# EAGLE schematic PCB_Draft_4 (EAGLE 9.6.2)
AUTHOR: R. Hall, A. Singh, K.Quizon; BOARD_NAME: ESP32 I2C Exp / M Driver; DOC_NUM: 0; PROJECT_NAME: R8-O7 PCB; REVISION: 4
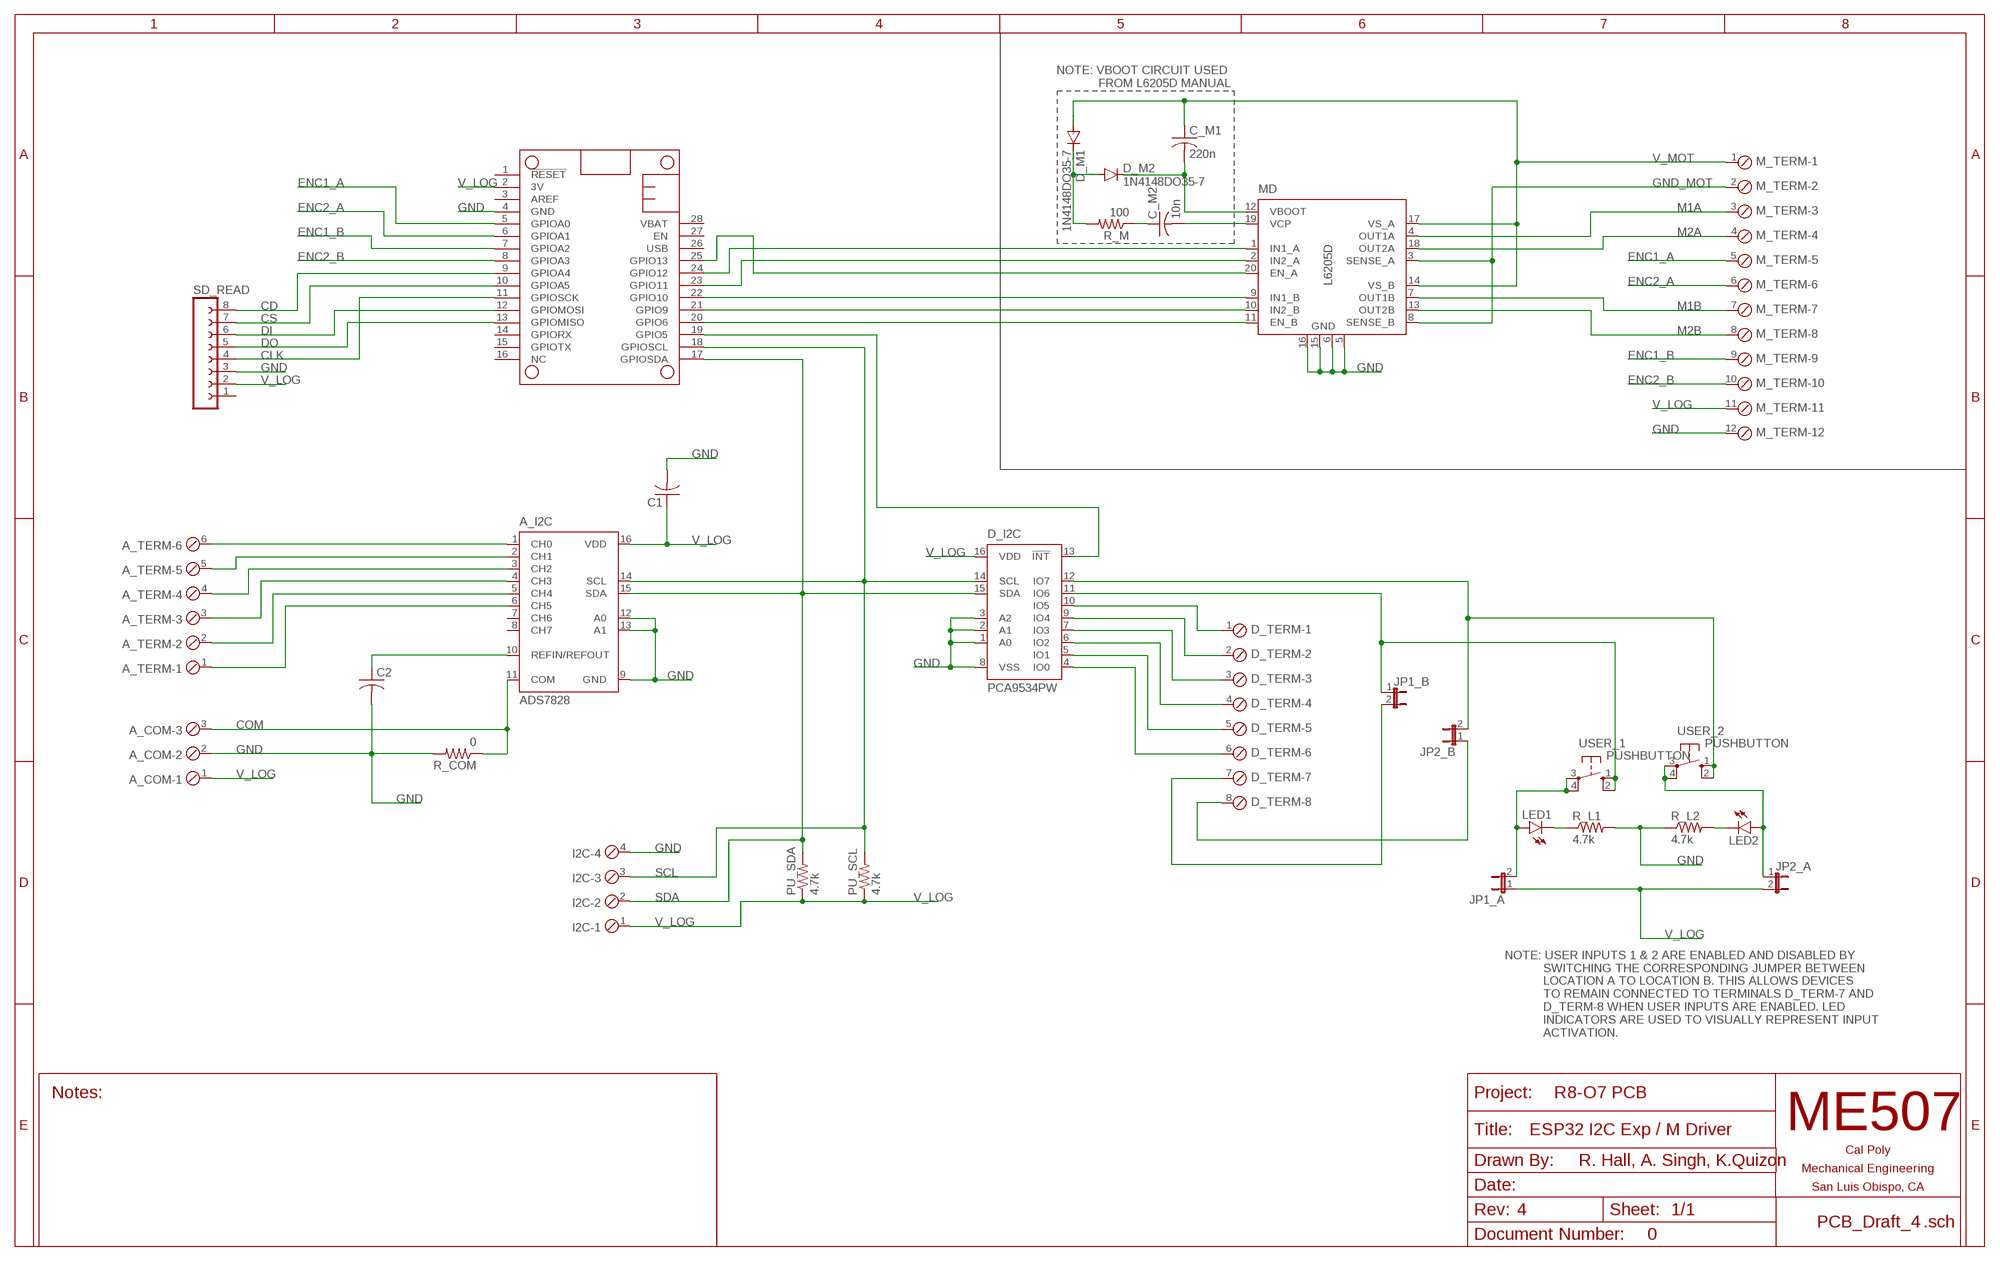
[diagram p0: schematic, sheet 1]

## Parts
A_COM  SCREWTERM_3P_254  [3POL254]
A_I2C  ADS7828  [TSSOP16-PW]
A_TERM  SCREWTERM_6P_254  [6POL254]
C1  C-USC0805  [C0805]
C2  C-USC0805  [C0805]
C_M1  220n  C-USC0805  [C0805]
C_M2  10n  C-USC0805  [C0805]
D_I2C  PCA9534PW  [TSSOP16]
D_M1  1N4148DO35-7  [DO35-7]
D_M2  1N4148DO35-7  [DO35-7]
D_TERM  SCREWTERM_8P_254  [8POL254]
FTHRWNG  FEATHERWINGEXTENDED_BOTH_ENDS  [FEATHERWING]
I2C  SCREWTERM_4P_254  [4POL254]
JP1_A  JP1E  [JP1]
JP1_B  JP1E  [JP1]
JP2_A  JP1E  [JP1]
JP2_B  JP1E  [JP1]
LED1  LEDCHIP-LED0805  [CHIP-LED0805]
LED2  LEDCHIP-LED0805  [CHIP-LED0805]
M_TERM  SCREWTERM_12P_254  [12POL254]
MD  L6205D  [SO20]
PU_SCL  4.7k  R-US_M0805  [M0805]
PU_SDA  4.7k  R-US_M0805  [M0805]
R_COM  0  R-US_M0805  [M0805]
R_L1  4.7k  R-US_M0805  [M0805]
R_L2  4.7k  R-US_M0805  [M0805]
R_M  100  R-US_M0805  [M0805]
SD_READ  FE08-1  [FE08]
USER_1  PUSHBUTTON  [B3F-10XX]
USER_2  PUSHBUTTON  [B3F-10XX]

## Nets
CD: FTHRWNG.9(GPIOA4) SD_READ.8
CLK: FTHRWNG.11(GPIOSCK) SD_READ.4
COM: A_COM.3 A_I2C.11(COM) R_COM.1
CS: FTHRWNG.10(GPIOA5) SD_READ.7
DI: FTHRWNG.12(GPIOMOSI) SD_READ.6
DO: FTHRWNG.13(GPIOMISO) SD_READ.5
ENC1_A: FTHRWNG.5(GPIOA0) M_TERM.5
ENC1_B: FTHRWNG.7(GPIOA2) M_TERM.9
ENC2_A: FTHRWNG.6(GPIOA1) M_TERM.6
ENC2_B: FTHRWNG.8(GPIOA3) M_TERM.10
GND: A_COM.2 A_I2C.9(GND) A_I2C.12(A0) A_I2C.13(A1) C1.2 C2.2 D_I2C.1(A0) D_I2C.2(A1) D_I2C.3(A2) D_I2C.8(VSS) FTHRWNG.4(GND) I2C.4 M_TERM.12 MD.5(GND) MD.6(GND) MD.15(GND) MD.16(GND) R_COM.2 R_L1.2 R_L2.1 SD_READ.3
GND_MOT: M_TERM.2 MD.3(SENSE_A) MD.8(SENSE_B)
M1A: M_TERM.3 MD.4(OUT1A)
M1B: M_TERM.7 MD.7(OUT1B)
M2A: M_TERM.4 MD.18(OUT2A)
M2B: M_TERM.8 MD.13(OUT2B)
N$1: D_I2C.12(IO7) JP2_B.2 USER_2.1(S) USER_2.2(S1)
N$2: D_I2C.11(IO6) JP1_B.1 USER_1.1(S) USER_1.2(S1)
N$3: D_I2C.10(IO5) D_TERM.1
N$4: D_I2C.9(IO4) D_TERM.2
N$5: D_I2C.7(IO3) D_TERM.3
N$6: D_I2C.6(IO2) D_TERM.4
N$8: D_TERM.7 JP1_B.2
N$9: A_I2C.1(CH0) A_TERM.6
N$10: A_I2C.2(CH1) A_TERM.5
N$11: A_I2C.3(CH2) A_TERM.4
N$12: A_I2C.4(CH3) A_TERM.3
N$13: A_I2C.5(CH4) A_TERM.2
N$14: A_I2C.6(CH5) A_TERM.1
N$17: A_I2C.10(REFIN/REFOUT) C2.1
N$18: FTHRWNG.20(GPIO6) MD.11(EN_B)
N$19: D_I2C.13(!INT) FTHRWNG.19(GPIO5)
N$20: FTHRWNG.21(GPIO9) MD.10(IN2_B)
N$21: FTHRWNG.22(GPIO10) MD.9(IN1_B)
N$22: FTHRWNG.23(GPIO11) MD.2(IN2_A)
N$23: FTHRWNG.24(GPIO12) MD.1(IN1_A)
N$25: FTHRWNG.25(GPIO13) MD.20(EN_A)
N$26: JP1_A.2 LED1.A USER_1.3(P) USER_1.4(P1)
N$27: JP2_A.1 LED2.A USER_2.3(P) USER_2.4(P1)
N$29: LED1.C R_L1.1
N$30: LED2.C R_L2.2
N$32: D_I2C.5(IO1) D_TERM.5
N$33: D_I2C.4(IO0) D_TERM.6
N$35: D_TERM.8 JP2_B.1
N$44: C_M2.1 R_M.1
N$45: D_M1.C D_M2.A R_M.2
SCL: A_I2C.14(SCL) D_I2C.14(SCL) FTHRWNG.18(GPIOSCL) I2C.3 PU_SCL.2
SDA: A_I2C.15(SDA) D_I2C.15(SDA) FTHRWNG.17(GPIOSDA) I2C.2 PU_SDA.2
V_LOG: A_COM.1 A_I2C.16(VDD) C1.1 D_I2C.16(VDD) FTHRWNG.2(3V) I2C.1 JP1_A.1 JP2_A.2 M_TERM.11 PU_SCL.1 PU_SDA.1 SD_READ.2
V_MOT: C_M1.1 D_M1.A M_TERM.1 MD.14(VS_B) MD.17(VS_A)
VBOOT: C_M1.2 D_M2.C MD.12(VBOOT)
VCP: C_M2.2 MD.19(VCP)
Unconnected: A_I2C.7(CH6) A_I2C.8(CH7) FTHRWNG.1(!RESET) FTHRWNG.3(AREF) FTHRWNG.14(GPIORX) FTHRWNG.15(GPIOTX) FTHRWNG.16(NC) FTHRWNG.26(USB) FTHRWNG.27(EN) FTHRWNG.28(VBAT) SD_READ.1

## Notes on the sheet
- NOTE: VBOOT CIRCUIT USED 
              FROM L6205D MANUAL
- NOTE: USER INPUTS 1 & 2 ARE ENABLED AND DISABLED BY   
             SWITCHING THE CORRESPONDING JUMPER BETWEEN 
             LOCATION A TO LOCATION B. THIS ALLOWS DEVICES 
             TO REMAIN CONNECTED TO TERMINALS D_TERM-7 AND 
             D_TERM-8 WHEN USER INPUTS ARE ENABLED. LED 
             INDICATORS ARE USED TO VISUALLY REPRESENT INPUT 
             ACTIVATION.

## Library data of the parts
A_COM = ME507:SCREWTERM_3P: Screw Terminal Block This part is designed for a screw terminal connector. The 2.54mm (0.100 inch) foorprint can also be used for male or female pin headers such as those on most development boards. One can also solder wires directly into the holes, though this makes modifications or repairs to the system more inconvenient. Larger versions can carry more current.
A_I2C = burr-brown:ADS7828: 12-Bit, 8-Channel Sampling ANALOG-TO-DIGITAL CONVERTER with I2C? Interface Source: www.ti.com .. ADS7828.pdf; MF: TEXAS INSTRUMENTS; MPN: ADS7828E/250; OC_FARNELL: 1470338; OC_NEWARK: 74C7158
A_TERM = ME507:SCREWTERM_6P: Screw Terminal Block This part is designed for a screw terminal connector. The 2.54mm (0.100 inch) foorprint can also be used for male or female pin headers such as those on most development boards. One can also solder wires directly into the holes, though this makes modifications or repairs to the system more inconvenient. Larger versions can carry more current.
C1 C2 C_M1 C_M2 = rcl:C-US: CAPACITOR, American symbol; SPICEPREFIX: C
D_I2C = micro-philips:PCA9534: 8-bit I2C-bus and SMBus low power I/O port with interrupt Source: www.nxp.com .. PCA9534_3.pdf; MPN: PCA9534PW; OC_FARNELL: 1408285; OC_NEWARK: 18M7516
D_M1 D_M2 = diode:1N4148: DIODE high speed (Philips)
D_TERM = ME507:SCREWTERM_8P: Screw Terminal Block This part is designed for a screw terminal connector. The 2.54mm (0.100 inch) foorprint can also be used for male or female pin headers such as those on most development boards. One can also solder wires directly into the holes, though this makes modifications or repairs to the system more inconvenient. Larger versions can carry more current.
FTHRWNG = ME507:FEATHERWING: AdaFruitTM Feather Wing A modified version of a Featherwing, the add-on board for an AdaFruit(tm) Feather development board. There is a standard size version which is the same size as the Feather board on which the microcontroller hangs out. There is also an extended version, with each and longer by a quarter inch to allow for connectors such as screw terminals which aren't hidden under another board if this wing isn't on the top of the board stack. The pins are named in a generic fashion; these names do not necessarily correspond to Arduino or Python pin numbers. The designer must refer to the pinout diagram for each specific Feather board to find the functions of each pin.
I2C = ME507:SCREWTERM_4P: Screw Terminal Block This part is designed for a screw terminal connector. The 2.54mm (0.100 inch) foorprint can also be used for male or female pin headers such as those on most development boards. One can also solder wires directly into the holes, though this makes modifications or repairs to the system more inconvenient. Larger versions can carry more current.
JP1_A JP1_B JP2_A JP2_B = jumper:JP1E: JUMPER
LED1 LED2 = led:LED: LED OSRAM: - CHIPLED LG R971, LG N971, LY N971, LG Q971, LY Q971, LO R971, LY R971 LH N974, LH R974 LS Q976, LO Q976, LY Q976 LO Q996 - Hyper CHIPLED LW Q18S LB Q993, LB Q99A, LB R99A - SideLED LS A670, LO A670, LY A670, LG A670, LP A670 LB A673, LV A673, LT A673, LW A673 LH A674 LY A675 LS A676, LA A676, LO A676, LY A676, LW A676 LS A679, LY A679, LG A679 - Hyper Micro SIDELED® LS Y876, LA Y876, LO Y876, LY Y876 LT Y87S - SmartLED LW L88C, LW L88S LB L89C, LB L89S, LG L890 LS L89K, LO L89K, LY L89K LS L896, LA L896, LO L896, LY L896 - TOPLED LS T670, LO T670, LY T670, LG T670, LP T670 LSG T670, LSP T670, LSY T670, LOP T670, LYG T670 LG T671, LOG T671, LSG T671 LB T673, LV T673, LT T673, LW T673 LH T674 LS T676, LA T676, LO T676, LY T676, LB T676, LH T676, LSB T676, LW T676 LB T67C, LV T67C, LT T67C, LS T67K, LO T67K, LY T67K, LW E67C LS E67B, LA E67B, LO E67B, LY E67B, LB E67C, LV E67C, LT E67C LW T67C LS T679, LY T679, LG T679 LS T770, LO T770, LY T770, LG T770, LP T770 LB T773, LV T773, LT T773, LW T773 LH T774 LS E675, LA E675, LY E675, LS T675 LS T776, LA T776, LO T776, LY T776, LB T776 LHGB T686 LT T68C, LB T68C - Hyper Mini TOPLED® LB M676 - Mini TOPLED Santana® LG M470 LS M47K, LO M47K, LY M47K Source: http://www.osram.convergy.de LUXEON: - LUMILED® LXK2-PW12-R00, LXK2-PW12-S00, LXK2-PW14-U00, LXK2-PW14-V00 LXK2-PM12-R00, LXK2-PM12-S00, LXK2-PM14-U00 LXK2-PE12-Q00, LXK2-PE12-R00, LXK2-PE12-S00, LXK2-PE14-T00, LXK2-PE14-U00 LXK2-PB12-K00, LXK2-PB12-L00, LXK2-PB12-M00, LXK2-PB14-N00, LXK2-PB14-P00, LXK2-PB14-Q00 LXK2-PR12-L00, LXK2-PR12-M00, LXK2-PR14-Q00, LXK2-PR14-R00 LXK2-PD12-Q00, LXK2-PD12-R00, LXK2-PD12-S00 LXK2-PH12-R00, LXK2-PH12-S00 LXK2-PL12-P00, LXK2-PL12-Q00, LXK2-PL12-R00 Source: www.luxeon.com KINGBRIGHT: KA-3528ASYC Source: www.kingbright.com
M_TERM = ME507:SCREWTERM_12P: Screw Terminal Block This part is designed for a screw terminal connector. The 2.54mm (0.100 inch) foorprint can also be used for male or female pin headers such as those on most development boards. One can also solder wires directly into the holes, though this makes modifications or repairs to the system more inconvenient. Larger versions can carry more current.
MD = st-microelectronics:L6205: DUAL DMOS FULL BRIDGE MOTOR DRIVER; MPN: L6205D; OC_FARNELL: unknown; OC_NEWARK: 37M3487
PU_SCL PU_SDA R_COM R_L1 R_L2 R_M = rcl:R-US_: RESISTOR, American symbol; SPICEPREFIX: R
SD_READ = con-lsta:FE08-1: FEMALE HEADER; OC_FARNELL: unknown; OC_NEWARK: unknown
USER_1 USER_2 = ME507:PUSHBUTTON: OMRON SWITCH; MPN: B3F-1000; OC_FARNELL: 176432; OC_NEWARK: 36M3542